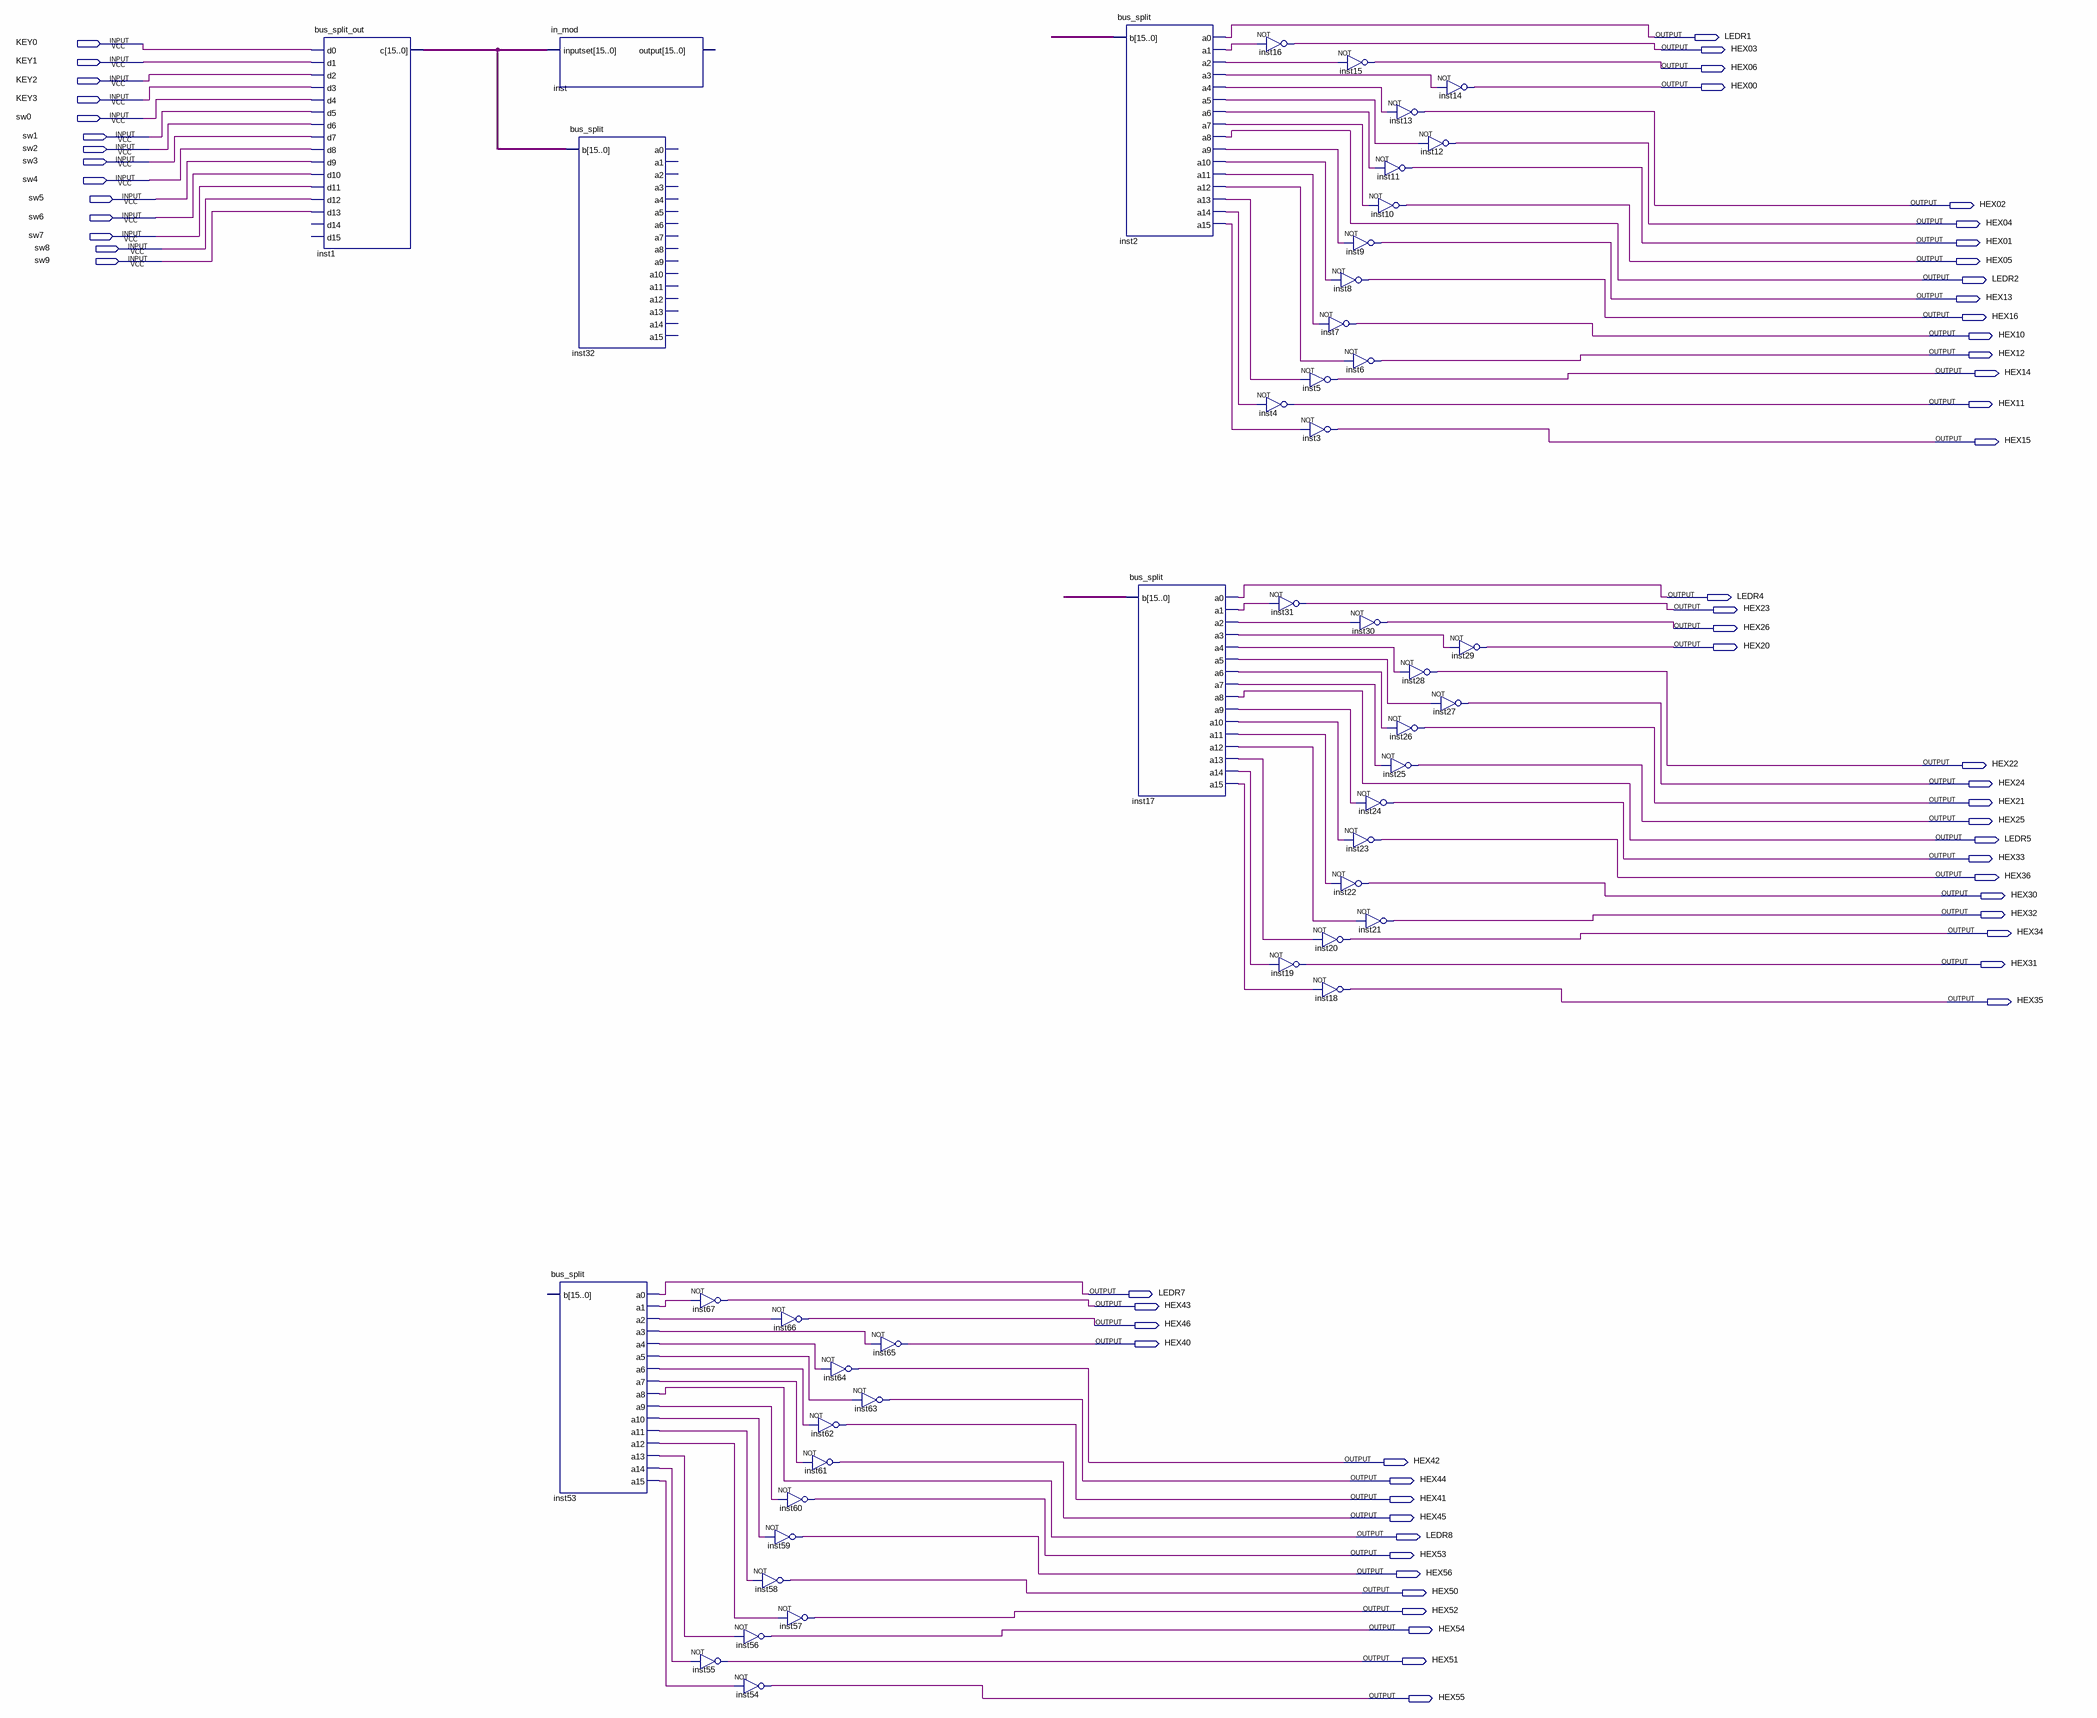
[diagram p0: schematic sheet]
// Quartus schematic in_out_mod.bdf as structural Verilog: 48 symbols, 62 pins
module in_out_mod (
  input  KEY0,
  input  KEY1,
  input  KEY2,
  input  KEY3,
  input  sw0,
  input  sw1,
  input  sw2,
  input  sw3,
  input  sw4,
  input  sw5,
  input  sw6,
  input  sw7,
  input  sw8,
  input  sw9,
  output LEDR1,
  output HEX03,
  output HEX06,
  output HEX00,
  output HEX02,
  output HEX04,
  output HEX01,
  output HEX05,
  output LEDR2,
  output HEX13,
  output HEX16,
  output HEX10,
  output HEX12,
  output HEX14,
  output HEX11,
  output HEX15,
  output LEDR4,
  output HEX23,
  output HEX26,
  output HEX20,
  output HEX22,
  output HEX24,
  output HEX21,
  output HEX25,
  output LEDR5,
  output HEX33,
  output HEX36,
  output HEX30,
  output HEX32,
  output HEX34,
  output HEX31,
  output HEX35,
  output LEDR7,
  output HEX43,
  output HEX46,
  output HEX40,
  output HEX42,
  output HEX44,
  output HEX41,
  output HEX45,
  output LEDR8,
  output HEX53,
  output HEX56,
  output HEX50,
  output HEX52,
  output HEX54,
  output HEX51,
  output HEX55
);

  wire inst2_a1, inst2_a2, inst2_a3, inst2_a4, inst2_a5, inst2_a6, inst2_a7, inst2_a9, inst2_a10, inst2_a11,
       inst2_a12, inst2_a13, inst2_a14, inst2_a15, inst17_a1, inst17_a2, inst17_a3, inst17_a4, inst17_a5,
       inst17_a6, inst17_a7, inst17_a9, inst17_a10, inst17_a11, inst17_a12, inst17_a13, inst17_a14,
       inst17_a15, inst53_a1, inst53_a2, inst53_a3, inst53_a4, inst53_a5, inst53_a6, inst53_a7, inst53_a9,
       inst53_a10, inst53_a11, inst53_a12, inst53_a13, inst53_a14, inst53_a15;
  wire [15:0] inst1_c, undriven, undriven_2;

  bus_split_out inst1 (
    .d0(KEY0), .d1(KEY1), .d2(KEY2), .d3(KEY3), .d4(sw0), .d5(sw1), .d6(sw2), .d7(sw3), .d8(sw4), .d9(sw5),
    .d10(sw6), .d11(sw7), .d12(sw8), .d13(sw9), .c(inst1_c));  // open: d14, d15
  in_mod inst (.inputset(inst1_c));  // open: output
  bus_split inst53 (
    .a0(LEDR7), .a1(inst53_a1), .a2(inst53_a2), .a3(inst53_a3), .a4(inst53_a4), .a5(inst53_a5),
    .a6(inst53_a6), .a7(inst53_a7), .a8(LEDR8), .a9(inst53_a9), .a10(inst53_a10), .a11(inst53_a11),
    .a12(inst53_a12), .a13(inst53_a13), .a14(inst53_a14), .a15(inst53_a15));  // open: b
  bus_split inst32 (.b(inst1_c));  // open: a0, a1, a2, a3, a4, a5, a6, a7, a8, a9, a10, a11, a12, a13, a14, a15
  not inst67 (HEX43, inst53_a1);
  not inst55 (HEX51, inst53_a14);
  not inst58 (HEX50, inst53_a11);
  not inst56 (HEX54, inst53_a13);
  not inst54 (HEX55, inst53_a15);
  not inst66 (HEX46, inst53_a2);
  not inst61 (HEX45, inst53_a7);
  not inst60 (HEX53, inst53_a9);
  not inst59 (HEX56, inst53_a10);
  not inst57 (HEX52, inst53_a12);
  not inst64 (HEX42, inst53_a4);
  not inst63 (HEX44, inst53_a5);
  not inst62 (HEX41, inst53_a6);
  not inst65 (HEX40, inst53_a3);
  bus_split inst2 (
    .b(undriven), .a0(LEDR1), .a1(inst2_a1), .a2(inst2_a2), .a3(inst2_a3), .a4(inst2_a4), .a5(inst2_a5),
    .a6(inst2_a6), .a7(inst2_a7), .a8(LEDR2), .a9(inst2_a9), .a10(inst2_a10), .a11(inst2_a11),
    .a12(inst2_a12), .a13(inst2_a13), .a14(inst2_a14), .a15(inst2_a15));
  bus_split inst17 (
    .b(undriven_2), .a0(LEDR4), .a1(inst17_a1), .a2(inst17_a2), .a3(inst17_a3), .a4(inst17_a4),
    .a5(inst17_a5), .a6(inst17_a6), .a7(inst17_a7), .a8(LEDR5), .a9(inst17_a9), .a10(inst17_a10),
    .a11(inst17_a11), .a12(inst17_a12), .a13(inst17_a13), .a14(inst17_a14), .a15(inst17_a15));
  not inst16 (HEX03, inst2_a1);
  not inst5 (HEX14, inst2_a13);
  not inst4 (HEX11, inst2_a14);
  not inst3 (HEX15, inst2_a15);
  not inst31 (HEX23, inst17_a1);
  not inst19 (HEX31, inst17_a14);
  not inst15 (HEX06, inst2_a2);
  not inst9 (HEX13, inst2_a9);
  not inst8 (HEX16, inst2_a10);
  not inst7 (HEX10, inst2_a11);
  not inst6 (HEX12, inst2_a12);
  not inst30 (HEX26, inst17_a2);
  not inst23 (HEX36, inst17_a10);
  not inst22 (HEX30, inst17_a11);
  not inst20 (HEX34, inst17_a13);
  not inst18 (HEX35, inst17_a15);
  not inst13 (HEX02, inst2_a4);
  not inst11 (HEX01, inst2_a6);
  not inst10 (HEX05, inst2_a7);
  not inst28 (HEX22, inst17_a4);
  not inst26 (HEX21, inst17_a6);
  not inst25 (HEX25, inst17_a7);
  not inst24 (HEX33, inst17_a9);
  not inst21 (HEX32, inst17_a12);
  not inst14 (HEX00, inst2_a3);
  not inst12 (HEX04, inst2_a5);
  not inst29 (HEX20, inst17_a3);
  not inst27 (HEX24, inst17_a5);
endmodule
